# EAGLE design Res_Cut (EAGLE 9.6.1)
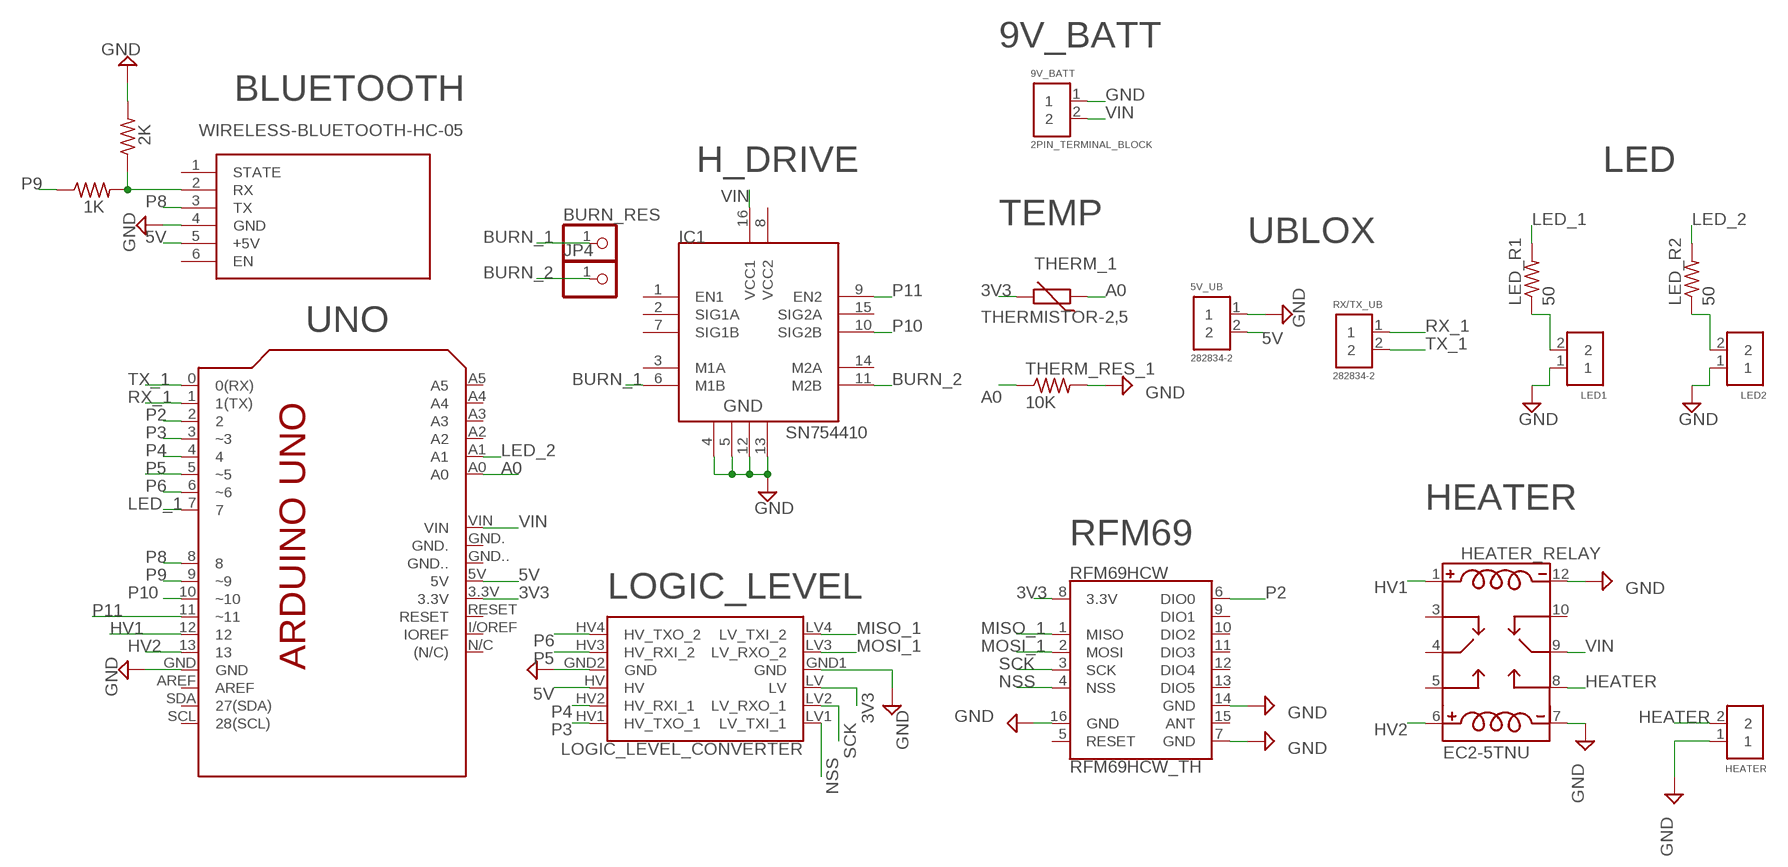
[diagram p0: schematic, sheet 1]

## Parts
5V_UB  282834-2  [CONN_282834-2]
9V_BATT  2PIN_TERMINAL_BLOCK  [2PIN_TERMINAL_BLOCK]
BLUE_R1  1K  R-US_0204/7  [0204/7]
BLUE_R2  2K  R-US_0204/7  [0204/7]
BURN_RES  PINHD-1X1CB  [1X01-CLEANBIG]
HEATER  2PIN_TERMINAL_BLOCK  [2PIN_TERMINAL_BLOCK]
HEATER_RELAY  EC2-5TNU  [RELAY_EC2-5TNU]
IC1  SN754410  [DIP16]
JP4  PINHD-1X1CB  [1X01-CLEANBIG]
LED1  282834-2  [CONN_282834-2]
LED2  282834-2  [CONN_282834-2]
LED_R1  50  R-US_0204/7  [0204/7]
LED_R2  50  R-US_0204/7  [0204/7]
LOGIC_LEVEL_CONVERTER  SPARKFUN_LOGIC_LEVEL_CONVERTER  [SPARKFUN_LOGIC_LEVEL_CONVERTER]
PCB1  ARDUINO_UNO  [ARDUINO_UNO]
RFM69HCW  RFM69HCW_TH  [RFM69HCW]
RX/TX_UB  282834-2  [CONN_282834-2]
THERM_1  THERMISTOR-2,5  [RS-2,5]
THERM_RES_1  10K  R-US_0204/7  [0204/7]
U$1  WIRELESS-BLUETOOTH-HC-05  [WIRELESS-BLUETOOTH-HC-05]

## Nets
3V3: LOGIC_LEVEL_CONVERTER.LV PCB1.3.3V RFM69HCW.8(3.3V) THERM_1.2
5V: 5V_UB.2 LOGIC_LEVEL_CONVERTER.HV PCB1.5V U$1.5(+5V)
A0: PCB1.A0 THERM_1.1 THERM_RES_1.1
BLUE_R2: LED2.2 LED_R2.1
BURN_1: BURN_RES.1 IC1.6(M1B)
BURN_2: IC1.11(M2B) JP4.1
GND: 5V_UB.1 9V_BATT.1 BLUE_R2.2 HEATER.1 HEATER_RELAY.7(C4) HEATER_RELAY.12(C2) IC1.4 IC1.5 IC1.12 IC1.13 LED1.1 LED2.1 LOGIC_LEVEL_CONVERTER.GND1(GND) LOGIC_LEVEL_CONVERTER.GND2(GND) PCB1.GND RFM69HCW.7(GND) RFM69HCW.16(GND) THERM_RES_1.2 U$1.4(GND)
HEATER: HEATER.2 HEATER_RELAY.8(NO)
HV1 [5V_Relay]: HEATER_RELAY.1(C1) PCB1.12
HV2 [5V_Relay]: HEATER_RELAY.6(C3) PCB1.13
LED_1: LED_R1.2 PCB1.7
LED_2: LED_R2.2 PCB1.A1
MISO_1: LOGIC_LEVEL_CONVERTER.LV4(LV_TXI_2) RFM69HCW.1(MISO)
MOSI_1: LOGIC_LEVEL_CONVERTER.LV3(LV_RXO_2) RFM69HCW.2(MOSI)
N$3: BLUE_R1.2 BLUE_R2.1 U$1.2(RX)
N$4: LED1.2 LED_R1.1
N$5: RFM69HCW.14(GND) ; supply symbol labelled GND
NSS: LOGIC_LEVEL_CONVERTER.LV1(LV_TXI_1) RFM69HCW.4(NSS)
P2: PCB1.2 RFM69HCW.6(DIO0)
P3: LOGIC_LEVEL_CONVERTER.HV1(HV_TXO_1) PCB1.3(~3)
P4: LOGIC_LEVEL_CONVERTER.HV2(HV_RXI_1) PCB1.4
P5: LOGIC_LEVEL_CONVERTER.HV3(HV_RXI_2) PCB1.5(~5)
P6: LOGIC_LEVEL_CONVERTER.HV4(HV_TXO_2) PCB1.6(~6)
P8: PCB1.8 U$1.3(TX)
P9: BLUE_R1.1 PCB1.9(~9)
P10: IC1.10(SIG2B) PCB1.10(~10)
P11: IC1.9(EN2) PCB1.11(~11)
RX_1: PCB1.1(1(TX)) RX/TX_UB.1
SCK: LOGIC_LEVEL_CONVERTER.LV2(LV_RXO_1) RFM69HCW.3(SCK)
TX_1: PCB1.0(0(RX)) RX/TX_UB.2
VIN: 9V_BATT.2 HEATER_RELAY.9(M) IC1.16(VCC1) PCB1.VIN
Unconnected: HEATER_RELAY.3(NC1) HEATER_RELAY.4(M1) HEATER_RELAY.5(NO1) HEATER_RELAY.10(NC) IC1.1(EN1) IC1.2(SIG1A) IC1.3(M1A) IC1.7(SIG1B) IC1.14(M2A) IC1.15(SIG2A) PCB1.A2 PCB1.A3 PCB1.A4 PCB1.A5 PCB1.AREF PCB1.GND. PCB1.GND.. PCB1.I/OREF(IOREF) PCB1.N/C((N/C)) PCB1.RESET PCB1.SCL(28(SCL)) PCB1.SDA(27(SDA)) RFM69HCW.5(RESET) RFM69HCW.9(DIO1) RFM69HCW.10(DIO2) RFM69HCW.11(DIO3) RFM69HCW.12(DIO4) RFM69HCW.13(DIO5) RFM69HCW.15(ANT) U$1.1(STATE) U$1.6(EN)

## Notes on the sheet
- 9V_BATT
- BLUETOOTH
- H_DRIVE | LED
- TEMP
- UBLOX
- UNO
- HEATER
- RFM69
- LOGIC_LEVEL

## Power pins joined to a net without a drawn wire
VCC2: IC1.8(VCC2)

## Library data of the parts
5V_UB LED1 LED2 RX/TX_UB = 282834-2:282834-2: Terminal block; 2.54mm; angled 90°; 0.03÷1mm2; ways: 2; 10A; H: 10mm; CENTERLINE_PITCH: 2.54 mm[.1 in]; COMMENT: 282834-2; DESCRIPTION: TERMI-BLOK PCB MOUNT, 90 2P.; DIGI-KEY_PART_NUMBER: A98333-ND; DIGI-KEY_PURCHASE_URL: https://www.digikey.com/product-detail/en/te-connectivity-amp-connectors/282834-2/A98333-ND/1150135?utm_source=snapeda&utm_medium=aggregator&utm_campaign=symbol; EU_ROHS_COMPLIANCE: Compliant with Exemptions; MF: TE Connectivity; MP: 282834-2; NUMBER_OF_POSITIONS: 2; PACKAGE: None; TE_PURCHASE_URL: https://www.te.com/usa-en/product-282834-2.html?te_bu=Cor&te_type=disp&te_campaign=seda_glo_cor-seda-global-disp-prtnr-fy19-seda-model-bom-cta_sma-317_1&elqCampaignId=32493
9V_BATT HEATER = Terminal_Block:2PIN_TERMINAL_BLOCK: Terminal block; 2.54mm; angled 90°; 0.03÷1mm2; ways: 2; 10A; H: 10mm; CENTERLINE_PITCH: 2.54 mm[.1 in]; COMMENT: 282834-2; DESCRIPTION: TERMI-BLOK PCB MOUNT, 90 2P.; DIGI-KEY_PART_NUMBER: A98333-ND; DIGI-KEY_PURCHASE_URL: https://www.digikey.com/product-detail/en/te-connectivity-amp-connectors/282834-2/A98333-ND/1150135?utm_source=snapeda&utm_medium=aggregator&utm_campaign=symbol; EU_ROHS_COMPLIANCE: Compliant with Exemptions; MF: TE Connectivity; MP: 282834-2; NUMBER_OF_POSITIONS: 2; PACKAGE: None; TE_PURCHASE_URL: https://www.te.com/usa-en/product-282834-2.html?te_bu=Cor&te_type=disp&te_campaign=seda_glo_cor-seda-global-disp-prtnr-fy19-seda-model-bom-cta_sma-317_1&elqCampaignId=32493
BLUE_R1 BLUE_R2 THERM_RES_1 = rcl:R-US_: RESISTOR, American symbol; SPICEPREFIX: R
BURN_RES JP4 = adafruit:PINHD-1X1: Pin header 1x1 for 0.1" spacing With round pins
HEATER_RELAY = EC2-5TNU:EC2-5TNU: Relay; E-Mech; Latching; DPDT; Ctrl-V 5DC; 2A; 250VAC; PCB Mnt; Thru Hole; EC2/EE2 Series; AVAILABILITY: Unavailable; DESCRIPTION: Relay; E-Mech; Latching; DPDT; Ctrl-V 5DC; 2A; 250VAC; PCB Mnt; Thru Hole; EC2/EE2 Series; MF: KEMET; MP: EC2-5TNU; PACKAGE: None; PRICE: None
IC1 = HBridge:SN754410: Quadruple half-H driver
LED_R1 LED_R2 = resistor:R-US_: RESISTOR, American symbol
LOGIC_LEVEL_CONVERTER = SparkFun-Boards:SPARKFUN_LOGIC_LEVEL_CONVERTER: SparkFun Logic Level Converter -Bi-Directional This is the mechnical outline for the 3.3V - 5V bi directional logic level converter. *Note, the "LOCK" Package has the header pins staggered by an offset of 5 mils (off center line), so that when you slide a row of standard 0.1" headers into the PTH pads, it will hold position vertically. See the follwing turorial for more information on this type of special footprints: Sneaky Footprints <https://www.sparkfun.com/tutorials/114> SparkFun Products: SparkFun Logic Level Converter - Bi-Directional <https://www.sparkfun.com/products/12009>
PCB1 = E14_Arduino_revC:ARDUINO_UNO: Device for representing an Arduino Uno board with a footprint in an EAGLE design. Created by Dave Young for Element14. More EAGLE documentation at: http://www.element14.com/community/community/knode/cadsoft_eagle
RFM69HCW = RFM69HCW_TH:RFM69HCW_TH: RFM69HCW Through Hole Library
THERM_1 = varistor:THERMISTOR: THERMISTOR
U$1 = diy-modules:WIRELESS-BLUETOOTH-HC-05: Bluetooth Transceiver Module based on HC-05 board Tutorial is available here: https://arduino-info.wikispaces.com/BlueTooth-HC05-HC06-Modules-How-To Click here to find device on ebay.com <http://www.ebay.com/sch/hc-05+module+rs232>

## Net classes
1 5V_Relay: width 0.305 mm, drill 0.35 mm, clearance 0.127 mm

## Board
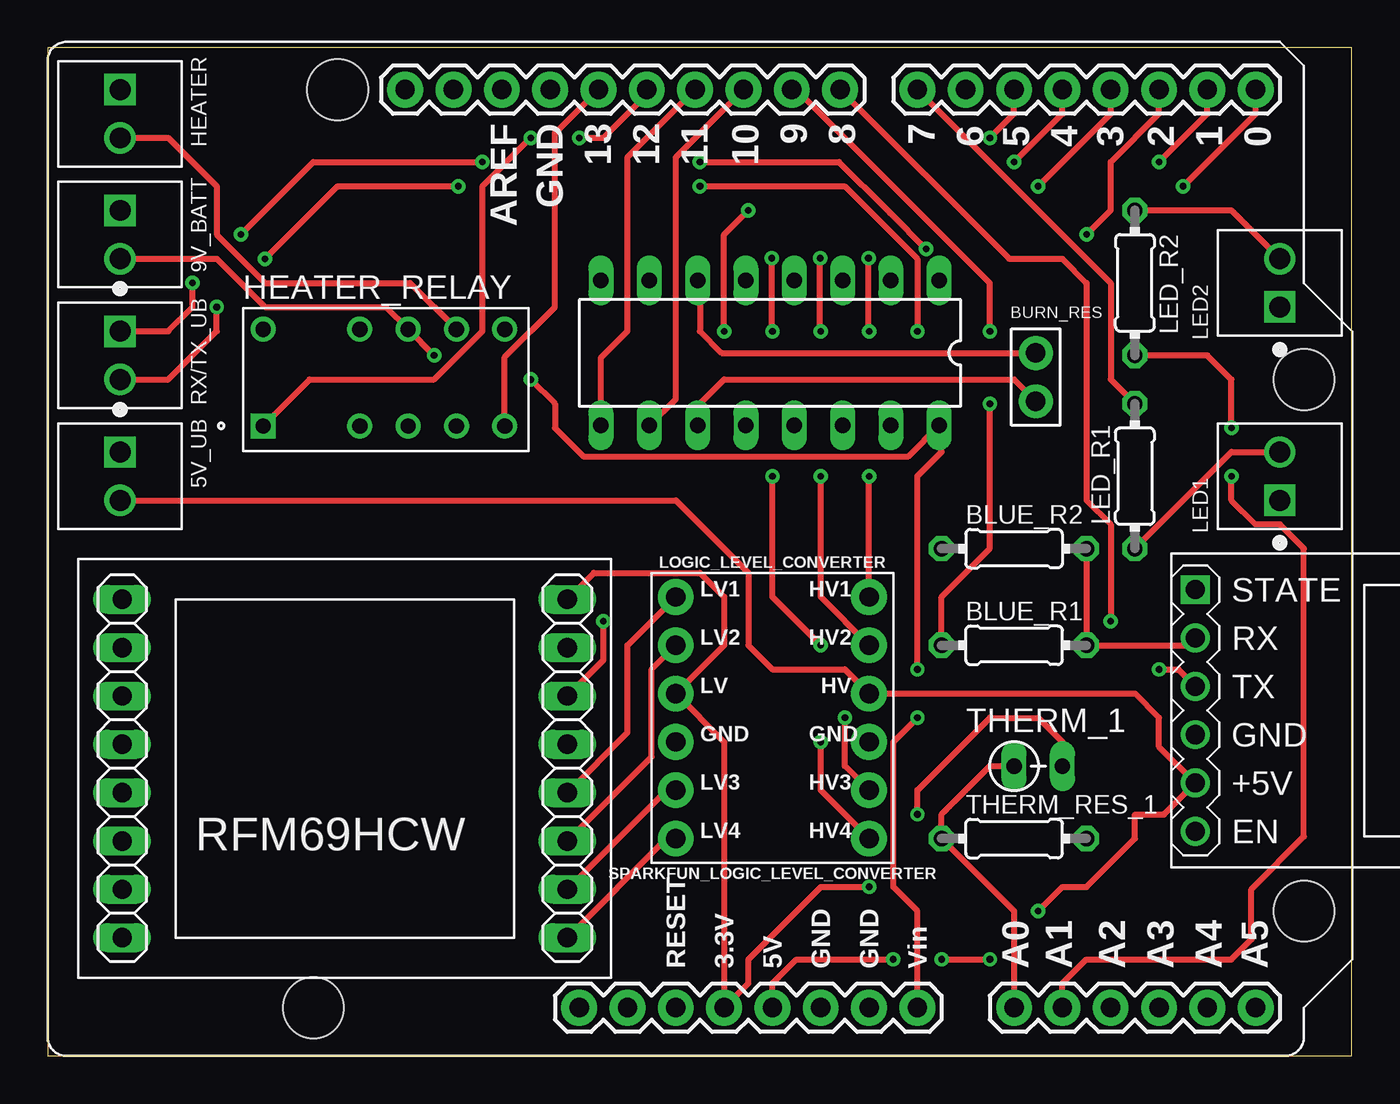
[diagram p1: board, top side]
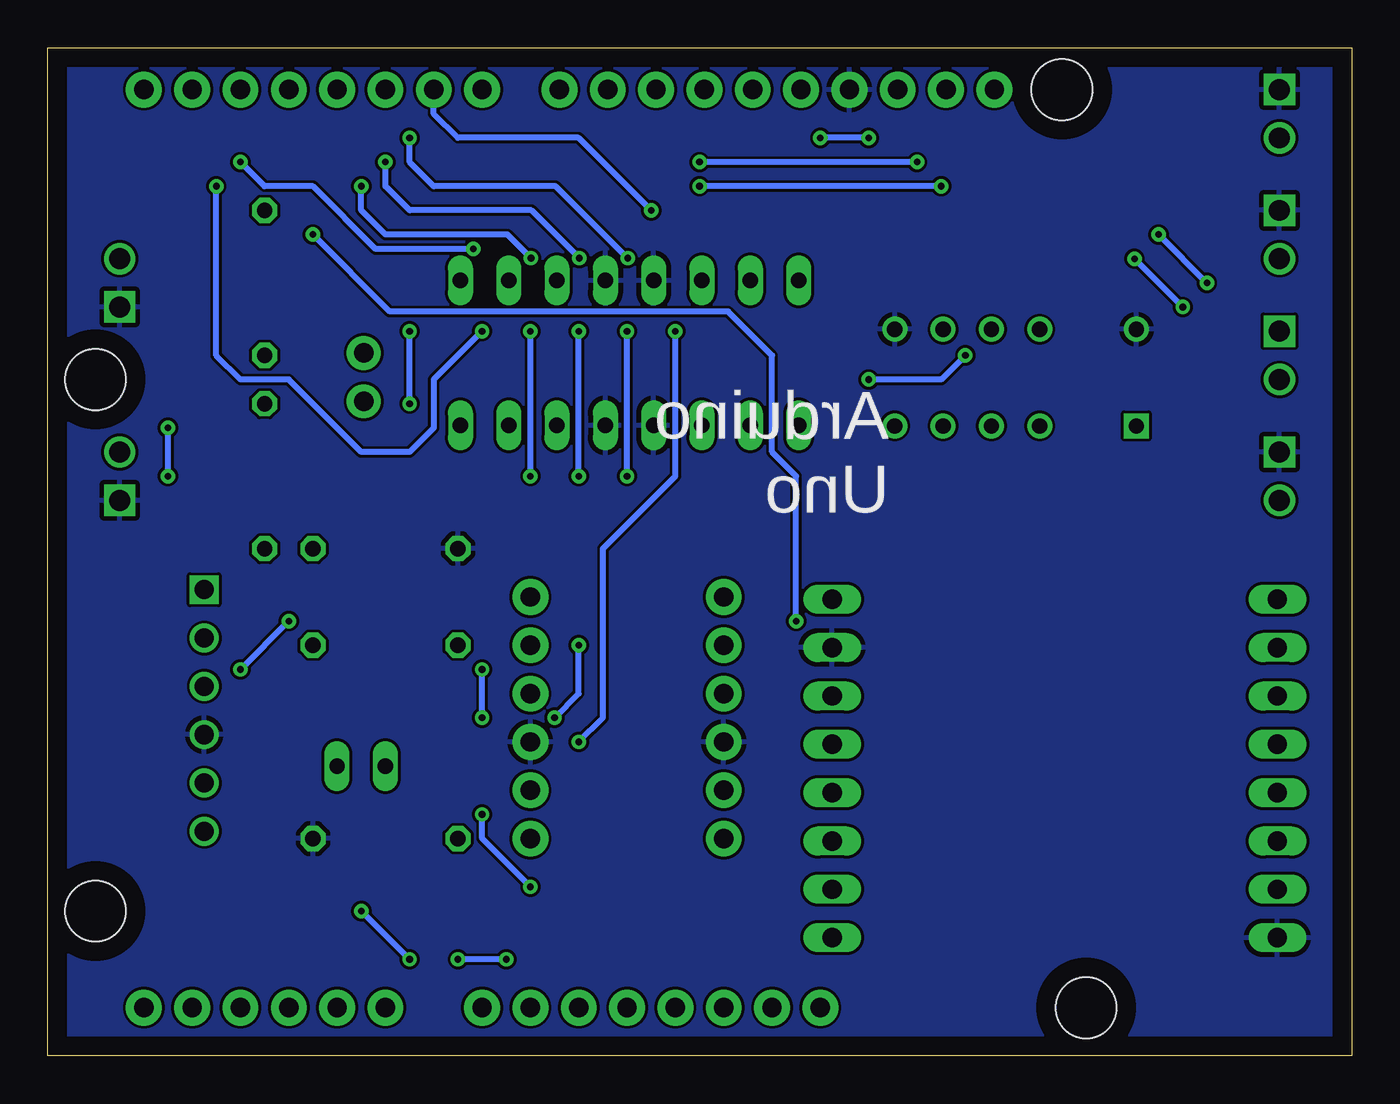
[diagram p2: board, bottom side, seen from below]

Size 68.56 x 53.01 mm. Coordinates in mm from the lower left corner, seen from the top.
Outline: 0,0 68.56,0 68.56,53.01 0,53.01 0,0
Copper layers (1*16): Top 0.035mm / dielectric 1.5mm / Bottom 0.035mm
Design rules "default": minimum track width 6mil, minimum drill 0.35mm, track to track 6mil, track to pad 6mil, pad to pad 6mil, via to via 6mil, smd to smd 6mil, copper to edge 40mil, drill to drill 6mil, minimum pad ring 10mil, minimum via ring 8mil, stop-mask expansion 4mil, vias tented up to drill 0mil, thermal gap 10mil

### Footprints (pad centres in the part's own frame; a part is rotated, then mirrored left to right if it is on the bottom)
CONN_282834-2 = drill 1.1 square: 1 -1.27,0 | drill 1.1: 2 1.27,0
2PIN_TERMINAL_BLOCK = drill 1.1 square: 1 -1.27,0 | drill 1.1: 2 1.27,0
0204/7 = drill 0.813 octagon: 1 -3.81,0; 2 3.81,0
1X01-CLEANBIG = drill 1.016 pad 1.778: 1 0,0
RELAY_EC2-5TNU = drill 0.8 square: 1 -6.45,-2.44 | drill 0.8: 3 -1.37,-2.44; 4 1.17,-2.44; 5 3.71,-2.44; 6 6.25,-2.44; 7 6.25,2.64; 8 3.71,2.64; 9 1.17,2.64; 10 -1.37,2.64; 12 -6.45,2.64
DIP16 = drill 0.813 long: 1 -10.16,-3.81; 2 -7.62,-3.81; 3 -5.08,-3.81; 4 -2.54,-3.81; 5 0,-3.81; 6 2.54,-3.81; 7 5.08,-3.81; 8 7.62,-3.81; 9 7.62,3.81; 10 5.08,3.81; 11 2.54,3.81; 12 0,3.81; 13 -2.54,3.81; 14 -5.08,3.81; 15 -7.62,3.81; 16 -10.16,3.81
SPARKFUN_LOGIC_LEVEL_CONVERTER = drill 1.016 pad 1.88: GND1 -5.08,-1.27; GND2 5.08,-1.27; HV 5.08,1.27; HV1 5.08,6.35; HV2 5.08,3.81; HV3 5.08,-3.81; HV4 5.08,-6.35; LV -5.08,1.27; LV1 -5.08,6.35; LV2 -5.08,3.81; LV3 -5.08,-3.81; LV4 -5.08,-6.35
ARDUINO_UNO = drill 1.016 pad 1.88: 0 63.5,50.8; 1 60.96,50.8; 2 58.42,50.8; 3 55.88,50.8; 3.3V 35.56,2.54; 4 53.34,50.8; 5 50.8,50.8; 5V 38.1,2.54; 6 48.26,50.8; 7 45.72,50.8; 8 41.656,50.8; 9 39.116,50.8; 10 36.576,50.8; 11 34.036,50.8; 12 31.496,50.8; 13 28.956,50.8; A0 50.8,2.54; A1 53.34,2.54; A2 55.88,2.54; A3 58.42,2.54; A4 60.96,2.54; A5 63.5,2.54; AREF 23.876,50.8; GND 26.416,50.8; GND. 43.18,2.54; GND.. 40.64,2.54; I/OREF 30.48,2.54; N/C 27.94,2.54; RESET 33.02,2.54; SCL 18.796,50.8; SDA 21.336,50.8; VIN 45.72,2.54 | hole 3.2: 66.04,7.62; 66.04,35.56; 15.24,50.8; 13.97,2.54
RFM69HCW = drill 1.016 long: 1 -11.7,8.89; 2 -11.7,6.35; 3 -11.7,3.81; 4 -11.7,1.27; 5 -11.7,-1.27; 6 -11.7,-3.81; 7 -11.7,-6.35; 8 -11.7,-8.89; 9 11.7,-8.89; 10 11.7,-6.35; 11 11.7,-3.81; 12 11.7,-1.27; 13 11.7,1.27; 14 11.7,3.81; 15 11.7,6.35; 16 11.7,8.89
RS-2,5 = drill 0.813 long: 1 -1.27,0; 2 1.27,0
WIRELESS-BLUETOOTH-HC-05 = drill 1 square: 1 -6.35,-17.145 | drill 1: 2 -3.81,-17.145; 3 -1.27,-17.145; 4 1.27,-17.145; 5 3.81,-17.145; 6 6.35,-17.145

### Placement (x,y rotation side)
5V_UB  3.81,30.48 270 top
9V_BATT  3.81,43.18 270 top
BLUE_R1  50.8,21.59 0 top
BLUE_R2  50.8,26.67 180 top
BURN_RES  51.94,36.96 0 top
HEATER  3.81,49.53 270 top
HEATER_RELAY  17.78,35.56 0 top
IC1  36.7,36.96 180 top
JP4  51.94,34.42 0 top
LED1  64.77,30.48 90 top
LED2  64.77,40.64 90 top
LED_R1  57.15,30.48 90 top
LED_R2  57.15,40.64 270 top
LOGIC_LEVEL_CONVERTER  38.1,17.78 0 top
PCB1  0,0 0 top
RFM69HCW  15.62,15.11 180 top
RX/TX_UB  3.81,36.83 270 top
THERM_1  52.07,15.24 0 top
THERM_RES_1  50.8,11.43 0 top
U$1  77.47,18.16 270 top

### Tracks (layer width: path | path; a pad name or v marks a point on that pad's centre or on a via)
3V3  (via drill 0.35)
  Top 0.305: RFM69HCW.8 28.72,25.4 34.29,25.4 35.56,24.13 35.56,21.59 LOGIC_LEVEL_CONVERTER.LV 35.56,16.51 PCB1.3.3V 36.83,3.81 36.83,5.08 40.64,8.89 v43.18,8.89 | THERM_1.2 53.34,16.51 52.07,17.78 49.53,17.78 45.72,13.97 v45.72,12.7
  Bottom 0.305: v43.18,8.89 45.72,11.43 v45.72,12.7
5V  (via drill 0.35)
  Top 0.305: 5V_UB.2 33.02,29.21 36.83,25.4 36.83,21.59 38.1,20.32 41.91,20.32 LOGIC_LEVEL_CONVERTER.HV 57.15,19.05 58.42,17.78 58.42,16.26 U$1.5 58.67,12.7 57.15,12.7 57.15,11.43 54.61,8.89 53.34,8.89 v52.07,7.62 | PCB1.5V 38.1,3.81 39.37,5.08 v44.45,5.08 | v46.99,5.08 v49.53,5.08
  Bottom 0.305: v44.45,5.08 v46.99,5.08 | v49.53,5.08 v52.07,7.62
A0
  Top 0.305: PCB1.A0 50.8,7.62 THERM_RES_1.1 46.99,12.7 49.53,15.24 THERM_1.1
BLUE_R2
  Top 0.305: LED_R2.1 62.23,44.45 LED2.2
BURN_1
  Top 0.305: IC1.6 34.29,40.64 34.29,38.1 35.43,36.96 BURN_RES.1
BURN_2
  Top 0.305: IC1.11 34.29,33.27 34.29,34.29 35.56,35.56 50.8,35.56 JP4.1
GND
  pour Bottom: 0,53.34 0,0 68.58,0 68.58,53.34
HEATER
  Top 0.305: HEATER.2 6.35,48.26 8.89,45.72 8.89,43.18 11.43,40.64 19.05,40.64 HEATER_RELAY.8
HV1  (via drill 0.35)
  Top 0.305: 11.53,33.12 HEATER_RELAY.1 13.77,35.56 20.32,35.56 22.86,38.1 22.86,45.72 v25.4,48.26 | v27.94,48.26 29.21,48.26 31.5,50.55 PCB1.12
  Bottom 0.305: v25.4,48.26 v27.94,48.26
HV2
  Top 0.305: HEATER_RELAY.6 24.03,36.73 26.67,39.37 26.67,48.51 PCB1.13
LED_1
  Top 0.305: PCB1.7 55.88,40.64 55.88,35.56 LED_R1.2
LED_2  (via drill 0.35)
  Top 0.305: PCB1.A1 53.34,3.81 54.61,5.08 62.23,5.08 63.27,6.12 63.27,8.77 66.04,11.54 66.04,26.67 64.77,27.94 63.5,27.94 62.23,29.21 v62.23,30.48 | v62.23,33.02 62.23,35.56 60.96,36.83 LED_R2.2
  Bottom 0.305: v62.23,30.48 v62.23,33.02
MISO_1
  Top 0.305: RFM69HCW.1 32.53,11.43 LOGIC_LEVEL_CONVERTER.LV4
MOSI_1
  Top 0.305: RFM69HCW.2 32.53,13.97 LOGIC_LEVEL_CONVERTER.LV3
N$3
  Top 0.305: U$1.2 59.94,21.59 BLUE_R1.2 BLUE_R2.1
N$4
  Top 0.305: LED1.2 62.23,31.75 LED_R1.1
NSS
  Top 0.305: RFM69HCW.4 30.48,17 30.48,21.59 LOGIC_LEVEL_CONVERTER.LV1
P2  (via drill 0.35)
  Top 0.305: RFM69HCW.6 29.21,20.81 v29.21,22.86 | v54.61,43.18 55.88,44.45 55.88,46.99 58.42,49.53 PCB1.2
  Bottom 0.305: v29.21,22.86 29.21,30.48 30.48,31.75 30.48,36.83 32.79,39.14 50.57,39.14 v54.61,43.18
P3  (via drill 0.35)
  Top 0.305: LOGIC_LEVEL_CONVERTER.HV1 v43.18,30.48 | v52.07,45.72 55.88,49.53 PCB1.3 | v43.18,38.1 43.15,38.13 v43.15,41.94
  Bottom 0.305: v43.18,30.48 v43.18,38.1 | v43.15,41.94 44.39,43.18 50.8,43.18 52.07,44.45 v52.07,45.72
P4  (via drill 0.35)
  Top 0.305: LOGIC_LEVEL_CONVERTER.HV2 40.64,24.13 v40.64,30.48 | v50.8,46.99 53.34,49.53 PCB1.4 | v40.64,38.1 40.61,38.13 v40.61,41.94
  Bottom 0.305: v40.64,30.48 v40.64,38.1 | v40.61,41.94 43.12,44.45 49.53,44.45 50.8,45.72 v50.8,46.99
P5  (via drill 0.35)
  Top 0.305: LOGIC_LEVEL_CONVERTER.HV3 41.91,15.24 v41.91,17.78 | v40.64,21.59 38.1,24.13 v38.1,30.48 | v38.1,38.1 38.07,38.13 v38.07,41.94 | v49.53,48.26 50.8,49.53 PCB1.5
  Bottom 0.305: v41.91,17.78 40.64,19.05 v40.64,21.59 | v38.1,30.48 v38.1,38.1 | v38.07,41.94 41.85,45.72 48.26,45.72 49.53,46.99 v49.53,48.26
P6  (via drill 0.35)
  Top 0.305: LOGIC_LEVEL_CONVERTER.HV4 40.64,13.97 v40.64,16.51 | v35.56,38.1 35.56,43.18 v36.83,44.45
  Bottom 0.305: v40.64,16.51 39.37,17.78 39.37,26.67 35.56,30.48 v35.56,38.1 | PCB1.6 48.26,49.53 46.99,48.26 40.64,48.26 v36.83,44.45
P8  (via drill 0.35)
  Top 0.305: PCB1.8 50.55,41.91 53.34,41.91 54.61,40.64 54.61,29.21 55.88,27.94 v55.88,22.86 | v58.42,20.32 59.44,20.32 U$1.3
  Bottom 0.305: v55.88,22.86 v58.42,20.32
P9  (via drill 0.35)
  Top 0.305: BLUE_R1.1 46.99,24.13 49.53,26.67 v49.53,34.29 | v49.53,38.1 49.53,40.64 39.37,50.8 PCB1.9
  Bottom 0.305: v49.53,34.29 v49.53,38.1
P10
  Top 0.305: IC1.10 33.02,34.54 33.02,47.24 PCB1.10
P11
  Top 0.305: IC1.9 29.08,36.7 30.48,38.1 30.48,47.24 PCB1.11
RX_1  (via drill 0.35)
  Top 0.305: RX/TX_UB.1 6.35,38.1 7.62,39.37 v7.62,40.64 | v46.17,42.42 44.3,44.3 44.15,44.45 41.61,46.99 v34.29,46.99 | v58.42,46.99 60.96,49.53 PCB1.1 | v22.86,46.99 13.97,46.99 v10.16,43.18
  Bottom 0.305: v7.62,40.64 v10.16,43.18 | v46.17,42.42 51.31,42.42 54.61,45.72 57.15,45.72 v58.42,46.99 | v22.86,46.99 v34.29,46.99
SCK
  Top 0.305: RFM69HCW.3 31.75,15.73 31.75,20.32 LOGIC_LEVEL_CONVERTER.LV2
TX_1  (via drill 0.35)
  Top 0.305: RX/TX_UB.2 6.35,35.56 8.89,38.1 v8.89,39.37 | v45.72,38.1 45.72,41.91 41.91,45.72 v34.29,45.72 | v59.69,45.72 63.5,49.53 PCB1.0 | v11.43,41.91 15.24,45.72 v21.59,45.72
  Bottom 0.305: v8.89,39.37 v11.43,41.91 | v45.72,38.1 48.26,35.56 48.26,33.02 49.53,31.75 52.07,31.75 55.88,35.56 58.42,35.56 59.69,36.83 v59.69,45.72 | v21.59,45.72 v34.29,45.72
VIN  (via drill 0.35)
  Top 0.305: 9V_BATT.2 8.89,41.91 11.43,39.37 17.78,39.37 HEATER_RELAY.9 v20.32,36.83 | v25.4,35.56 26.67,34.29 26.67,33.02 28.17,31.52 45.24,31.52 IC1.16 46.99,33.02 46.99,31.75 45.72,30.48 v45.72,20.32 | PCB1.VIN 45.72,7.62 44.45,8.89 44.45,16.51 v45.72,17.78
  Bottom 0.305: v45.72,17.78 v45.72,20.32 | v20.32,36.83 21.59,35.56 v25.4,35.56